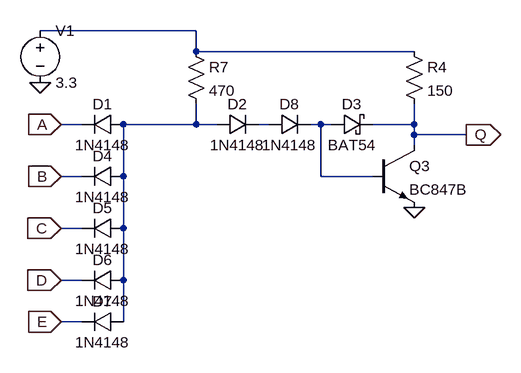
[diagram p0: schematic Nand5Clamp.asc]
Nand5Clamp.asc, the LTspice schematic file:
Version 4
SHEET 1 2532 952
WIRE 32 304 -208 304
WIRE 32 336 32 304
WIRE 368 336 32 336
WIRE -144 448 -176 448
WIRE 32 448 32 416
WIRE 32 448 -80 448
WIRE 64 448 32 448
WIRE 144 448 128 448
WIRE 224 448 208 448
WIRE 240 448 224 448
WIRE 368 448 368 416
WIRE 368 448 304 448
WIRE 368 464 368 448
WIRE 448 464 368 464
WIRE 368 480 368 464
WIRE -144 528 -176 528
WIRE -80 528 -80 448
WIRE 224 528 224 448
WIRE 304 528 224 528
WIRE -144 608 -176 608
WIRE -80 608 -80 528
WIRE -144 688 -176 688
WIRE -80 688 -80 608
WIRE -144 752 -176 752
WIRE -80 752 -80 688
FLAG 368 576 0
FLAG 448 464 Q
IOPIN 448 464 Out
FLAG -176 448 A
IOPIN -176 448 In
FLAG -176 528 B
IOPIN -176 528 In
FLAG -176 608 C
IOPIN -176 608 In
FLAG -176 688 D
IOPIN -176 688 In
FLAG -176 752 E
IOPIN -176 752 In
FLAG -208 384 0
SYMBOL npn 304 480 R0
SYMATTR InstName Q3
SYMATTR Value BC847B
SYMBOL res 352 320 R0
SYMATTR InstName R4
SYMATTR Value 150
SYMBOL res 16 320 R0
SYMATTR InstName R7
SYMATTR Value 470
SYMBOL schottky 240 464 R270
WINDOW 0 32 32 VTop 2
WINDOW 3 0 32 VBottom 2
SYMATTR InstName D3
SYMATTR Value BAT54
SYMATTR Description Diode
SYMATTR Type diode
SYMBOL diode -80 432 R90
WINDOW 0 0 32 VBottom 2
WINDOW 3 32 32 VTop 2
SYMATTR InstName D1
SYMATTR Value 1N4148
SYMBOL diode 64 432 M90
WINDOW 0 0 32 VBottom 2
WINDOW 3 32 32 VTop 2
SYMATTR InstName D2
SYMATTR Value 1N4148
SYMBOL diode 144 432 M90
WINDOW 0 0 32 VBottom 2
WINDOW 3 32 32 VTop 2
SYMATTR InstName D8
SYMATTR Value 1N4148
SYMBOL diode -80 512 R90
WINDOW 0 0 32 VBottom 2
WINDOW 3 32 32 VTop 2
SYMATTR InstName D4
SYMATTR Value 1N4148
SYMBOL diode -80 592 R90
WINDOW 0 0 32 VBottom 2
WINDOW 3 32 32 VTop 2
SYMATTR InstName D5
SYMATTR Value 1N4148
SYMBOL diode -80 672 R90
WINDOW 0 0 32 VBottom 2
WINDOW 3 32 32 VTop 2
SYMATTR InstName D6
SYMATTR Value 1N4148
SYMBOL diode -80 736 R90
WINDOW 0 0 32 VBottom 2
WINDOW 3 32 32 VTop 2
SYMATTR InstName D7
SYMATTR Value 1N4148
SYMBOL voltage -208 288 R0
SYMATTR InstName V1
SYMATTR Value 3.3

The netlist it stands for:
* Nand5Clamp.asc
Q3 Q N004 0 0 BC847B
R4 N001 Q 150
R7 N001 N002 470
D3 N004 Q BAT54
D1 N002 A 1N4148
D2 N002 N003 1N4148
D8 N003 N004 1N4148
D4 N002 B 1N4148
D5 N002 C 1N4148
D6 N002 D 1N4148
D7 N002 E 1N4148
V1 N001 0 3.3
.model D D
.lib standard.dio
.model NPN NPN
.model PNP PNP
.lib standard.bjt
.backanno
.end